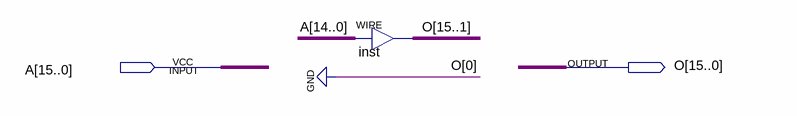
[diagram p0: schematic sheet]
// Quartus schematic shfl.bdf as structural Verilog: 1 symbols, 2 pins
module shfl (
  input  [15:0] A,
  output [15:0] O
);

  assign O[15:1] = A[14:0];  // WIRE inst

  assign O[0] = 1'b0;
endmodule
